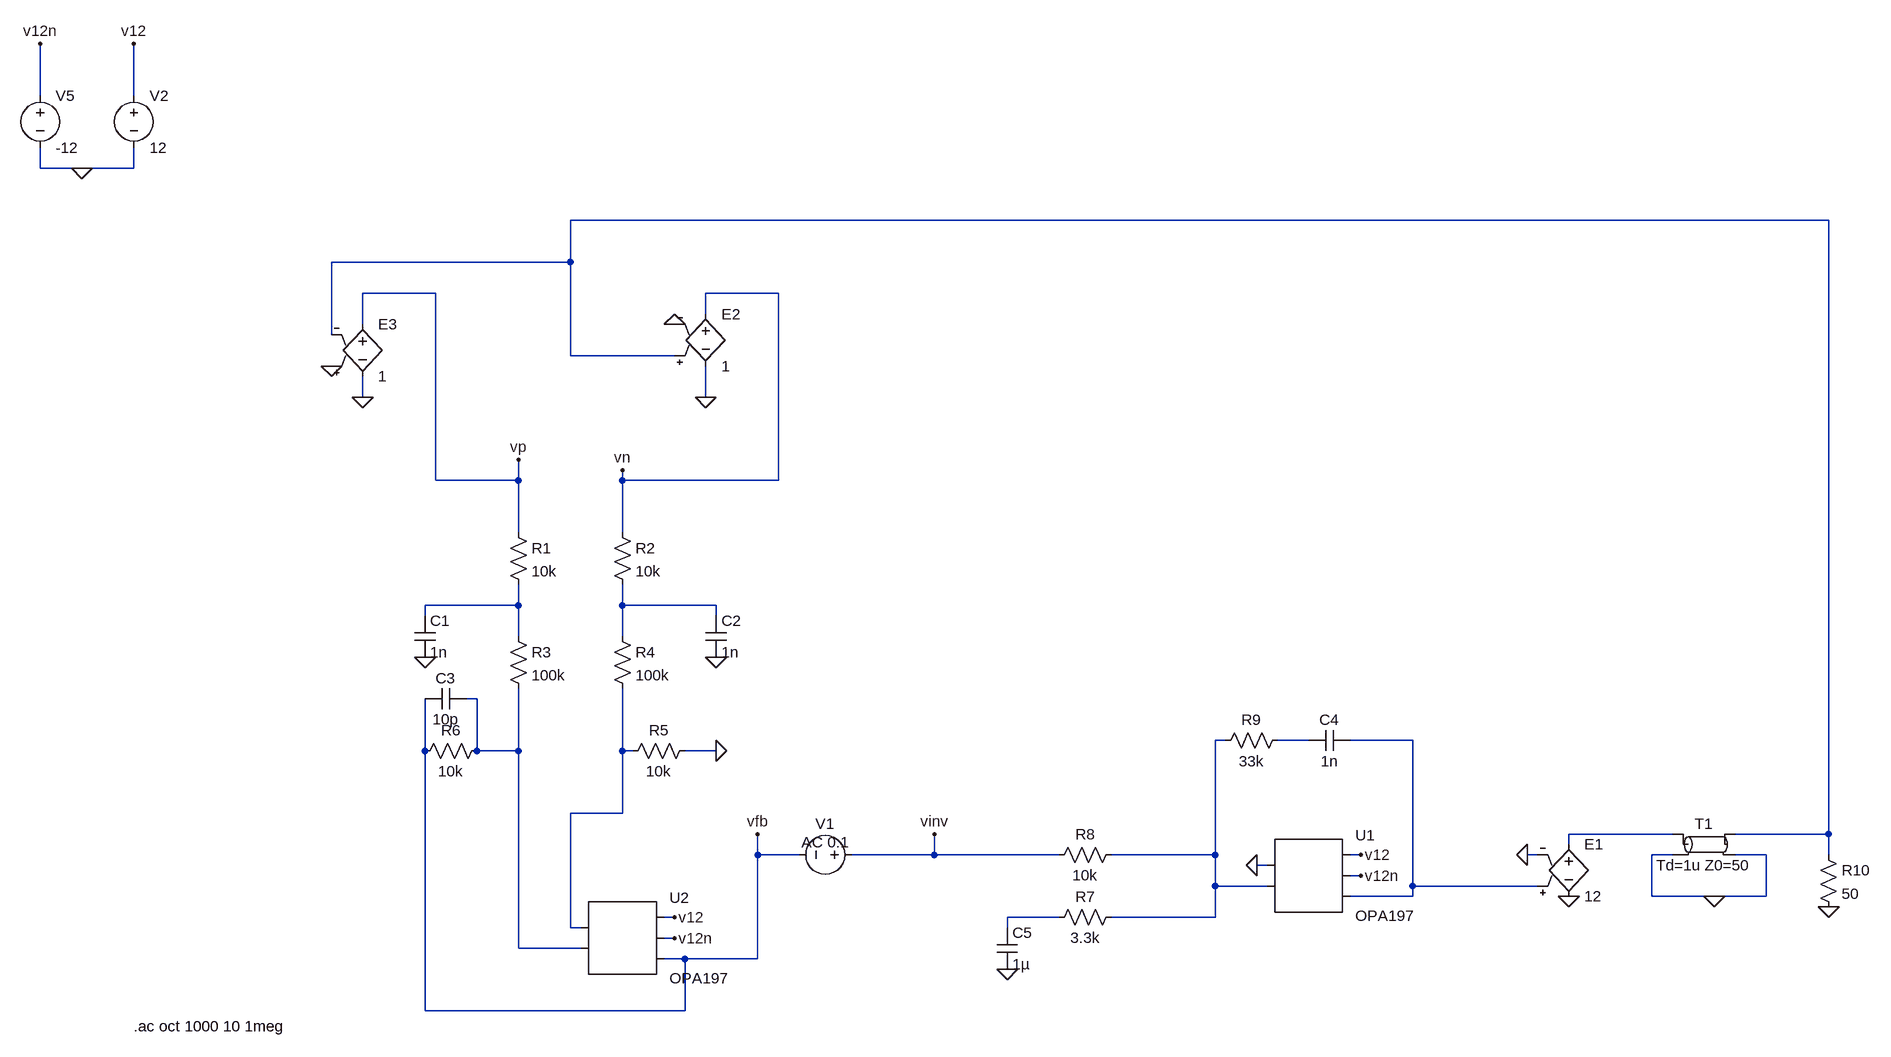
[diagram p0: schematic spice_schematic_ac_simulation.asc]
spice_schematic_ac_simulation.asc, the LTspice schematic file:
Version 4
SHEET 1 1668 1192
WIRE -6896 -6752 -6896 -6832
WIRE -6752 -6752 -6752 -6832
WIRE -6896 -6640 -6896 -6672
WIRE -6832 -6640 -6896 -6640
WIRE -6752 -6640 -6752 -6672
WIRE -6752 -6640 -6832 -6640
WIRE -4144 -6560 -6080 -6560
WIRE -6080 -6496 -6080 -6560
WIRE -6080 -6496 -6448 -6496
WIRE -6288 -6448 -6400 -6448
WIRE -5760 -6448 -5872 -6448
WIRE -5872 -6416 -5872 -6448
WIRE -6400 -6400 -6400 -6448
WIRE -6448 -6384 -6448 -6496
WIRE -6080 -6352 -6080 -6496
WIRE -5920 -6352 -6080 -6352
WIRE -6400 -6288 -6400 -6320
WIRE -5872 -6288 -5872 -6336
WIRE -6288 -6160 -6288 -6448
WIRE -6160 -6160 -6160 -6192
WIRE -6160 -6160 -6288 -6160
WIRE -6000 -6160 -6000 -6176
WIRE -5760 -6160 -5760 -6448
WIRE -5760 -6160 -6000 -6160
WIRE -6160 -6080 -6160 -6160
WIRE -6000 -6080 -6000 -6160
WIRE -6160 -5968 -6160 -6000
WIRE -6160 -5968 -6304 -5968
WIRE -6000 -5968 -6000 -6000
WIRE -5856 -5968 -6000 -5968
WIRE -6304 -5952 -6304 -5968
WIRE -5856 -5952 -5856 -5968
WIRE -6160 -5920 -6160 -5968
WIRE -6000 -5920 -6000 -5968
WIRE -6224 -5824 -6240 -5824
WIRE -5072 -5760 -5088 -5760
WIRE -4944 -5760 -4992 -5760
WIRE -4784 -5760 -4880 -5760
WIRE -6304 -5744 -6304 -5824
WIRE -6224 -5744 -6224 -5824
WIRE -6160 -5744 -6160 -5840
WIRE -6160 -5744 -6224 -5744
WIRE -6000 -5744 -6000 -5840
WIRE -5984 -5744 -6000 -5744
WIRE -5856 -5744 -5904 -5744
WIRE -6000 -5648 -6000 -5744
WIRE -6000 -5648 -6080 -5648
WIRE -4384 -5616 -4544 -5616
WIRE -4144 -5616 -4144 -6560
WIRE -4144 -5616 -4288 -5616
WIRE -4544 -5600 -4544 -5616
WIRE -5792 -5584 -5792 -5616
WIRE -5728 -5584 -5792 -5584
WIRE -5520 -5584 -5520 -5616
WIRE -5520 -5584 -5648 -5584
WIRE -5328 -5584 -5520 -5584
WIRE -5088 -5584 -5088 -5760
WIRE -5088 -5584 -5248 -5584
WIRE -4864 -5584 -4880 -5584
WIRE -4592 -5584 -4608 -5584
WIRE -4384 -5584 -4416 -5584
WIRE -4240 -5584 -4288 -5584
WIRE -4144 -5584 -4144 -5616
WIRE -5008 -5568 -5024 -5568
WIRE -4864 -5552 -4880 -5552
WIRE -5088 -5536 -5088 -5584
WIRE -5008 -5536 -5088 -5536
WIRE -4784 -5536 -4784 -5760
WIRE -4592 -5536 -4784 -5536
WIRE -4784 -5520 -4784 -5536
WIRE -4784 -5520 -4880 -5520
WIRE -4416 -5520 -4416 -5584
WIRE -4320 -5520 -4416 -5520
WIRE -4240 -5520 -4240 -5584
WIRE -4240 -5520 -4320 -5520
WIRE -5920 -5488 -5936 -5488
WIRE -5328 -5488 -5408 -5488
WIRE -5088 -5488 -5088 -5536
WIRE -5088 -5488 -5248 -5488
WIRE -6080 -5472 -6080 -5648
WIRE -6064 -5472 -6080 -5472
WIRE -5408 -5472 -5408 -5488
WIRE -5920 -5456 -5936 -5456
WIRE -6160 -5440 -6160 -5744
WIRE -6064 -5440 -6160 -5440
WIRE -5904 -5424 -5936 -5424
WIRE -5792 -5424 -5792 -5584
WIRE -5792 -5424 -5904 -5424
WIRE -6304 -5344 -6304 -5744
WIRE -5904 -5344 -5904 -5424
WIRE -5904 -5344 -6304 -5344
FLAG -6304 -5888 0
FLAG -5856 -5888 0
FLAG -6752 -6832 v12
FLAG -4608 -5584 0
FLAG -4544 -5520 0
FLAG -4320 -5520 0
FLAG -4144 -5504 0
FLAG -5920 -6400 0
FLAG -6448 -6336 0
FLAG -5520 -5616 vinv
FLAG -5792 -5616 vfb
FLAG -5408 -5408 0
FLAG -6160 -6192 vp
FLAG -6000 -6176 vn
FLAG -6896 -6832 v12n
FLAG -5920 -5488 v12
FLAG -5920 -5456 v12n
FLAG -5856 -5744 0
FLAG -5872 -6288 0
FLAG -6400 -6288 0
FLAG -6832 -6640 0
FLAG -5024 -5568 0
FLAG -4864 -5584 v12
FLAG -4864 -5552 v12n
SYMBOL res -6176 -6096 R0
SYMATTR InstName R1
SYMATTR Value 10k
SYMBOL res -6016 -6096 R0
SYMATTR InstName R2
SYMATTR Value 10k
SYMBOL res -6176 -5936 R0
SYMATTR InstName R3
SYMATTR Value 100k
SYMBOL res -6016 -5936 R0
SYMATTR InstName R4
SYMATTR Value 100k
SYMBOL res -5888 -5760 R90
WINDOW 0 0 56 VBottom 2
WINDOW 3 32 56 VTop 2
SYMATTR InstName R5
SYMATTR Value 10k
SYMBOL res -6208 -5760 R90
WINDOW 0 0 56 VBottom 2
WINDOW 3 32 56 VTop 2
SYMATTR InstName R6
SYMATTR Value 10k
SYMBOL cap -6320 -5952 R0
SYMATTR InstName C1
SYMATTR Value 1n
SYMBOL cap -5872 -5952 R0
SYMATTR InstName C2
SYMATTR Value 1n
SYMBOL voltage -6752 -6768 R0
WINDOW 123 0 0 Left 2
WINDOW 39 0 0 Left 2
SYMATTR InstName V2
SYMATTR Value 12
SYMBOL res -5232 -5600 R90
WINDOW 0 0 56 VBottom 2
WINDOW 3 32 56 VTop 2
SYMATTR InstName R8
SYMATTR Value 10k
SYMBOL e2 -4544 -5616 R0
SYMATTR InstName E1
SYMATTR Value 12
SYMBOL res -4160 -5600 R0
SYMATTR InstName R10
SYMATTR Value 50
SYMBOL cap -6240 -5840 R90
WINDOW 0 0 32 VBottom 2
WINDOW 3 32 32 VTop 2
SYMATTR InstName C3
SYMATTR Value 10p
SYMBOL e2 -5872 -6432 R0
SYMATTR InstName E2
SYMATTR Value 1
SYMBOL e2 -6400 -6416 R0
SYMATTR InstName E3
SYMATTR Value 1
SYMBOL voltage -6896 -6768 R0
WINDOW 123 0 0 Left 2
WINDOW 39 0 0 Left 2
SYMATTR InstName V5
SYMATTR Value -12
SYMBOL res -4976 -5776 R90
WINDOW 0 0 56 VBottom 2
WINDOW 3 32 56 VTop 2
SYMATTR InstName R9
SYMATTR Value 33k
SYMBOL cap -4880 -5776 R90
WINDOW 0 0 32 VBottom 2
WINDOW 3 32 32 VTop 2
SYMATTR InstName C4
SYMATTR Value 1n
SYMBOL tline -4336 -5600 R0
SYMATTR InstName T1
SYMATTR Value Td=1u Z0=50
SYMBOL res -5232 -5504 R90
WINDOW 0 0 56 VBottom 2
WINDOW 3 32 56 VTop 2
SYMATTR InstName R7
SYMATTR Value 3.3k
SYMBOL cap -5424 -5472 R0
SYMATTR InstName C5
SYMATTR Value 1µ
SYMBOL voltage -5632 -5584 R90
WINDOW 0 -32 56 VBottom 2
WINDOW 3 32 56 VTop 2
WINDOW 123 -4 56 VBottom 2
WINDOW 39 0 0 Left 2
SYMATTR InstName V1
SYMATTR Value ""
SYMATTR Value2 AC 0.1
SYMBOL AutoGenerated\\OPA197 -4944 -5552 R0
SYMATTR InstName U1
SYMBOL AutoGenerated\\OPA197 -6000 -5456 R0
SYMATTR InstName U2
TEXT -6752 -5320 Left 2 !.ac oct 1000 10 1meg

The netlist it stands for:
* spice_schematic_ac_simulation.asc
R1 vp N002 10k
R2 vn N003 10k
R3 N002 N004 100k
R4 N003 N008 100k
R5 0 N008 10k
R6 N004 vfb 10k
C1 N002 0 1n
C2 N003 0 1n
V2 v12 0 12
R8 N005 vinv 10k
E1 N009 0 N007 0 12
R10 N001 0 50
C3 N004 vfb 10p
E2 vn 0 N001 0 1
E3 vp 0 0 N001 1
V5 v12n 0 -12
R9 N006 N005 33k
C4 N007 N006 1n
T1 N009 0 N001 0 Td=1u Z0=50
R7 N005 N010 3.3k
C5 N010 0 1µ
V1 vinv vfb AC 0.1
* U1: OPA197 (symbol AutoGenerated\OPA197 not available, pins judged from their places): pin1=0 pin2=N005 pin3=v12 pin4=v12n pin5=N007
* U2: OPA197 (symbol AutoGenerated\OPA197 not available, pins judged from their places): pin1=N008 pin2=N004 pin3=v12 pin4=v12n pin5=vfb
.ac oct 1000 10 1meg
.backanno
.end